# Altium schematic sheet Sheet_1 copy.schdoc
size 441 x 303 mm
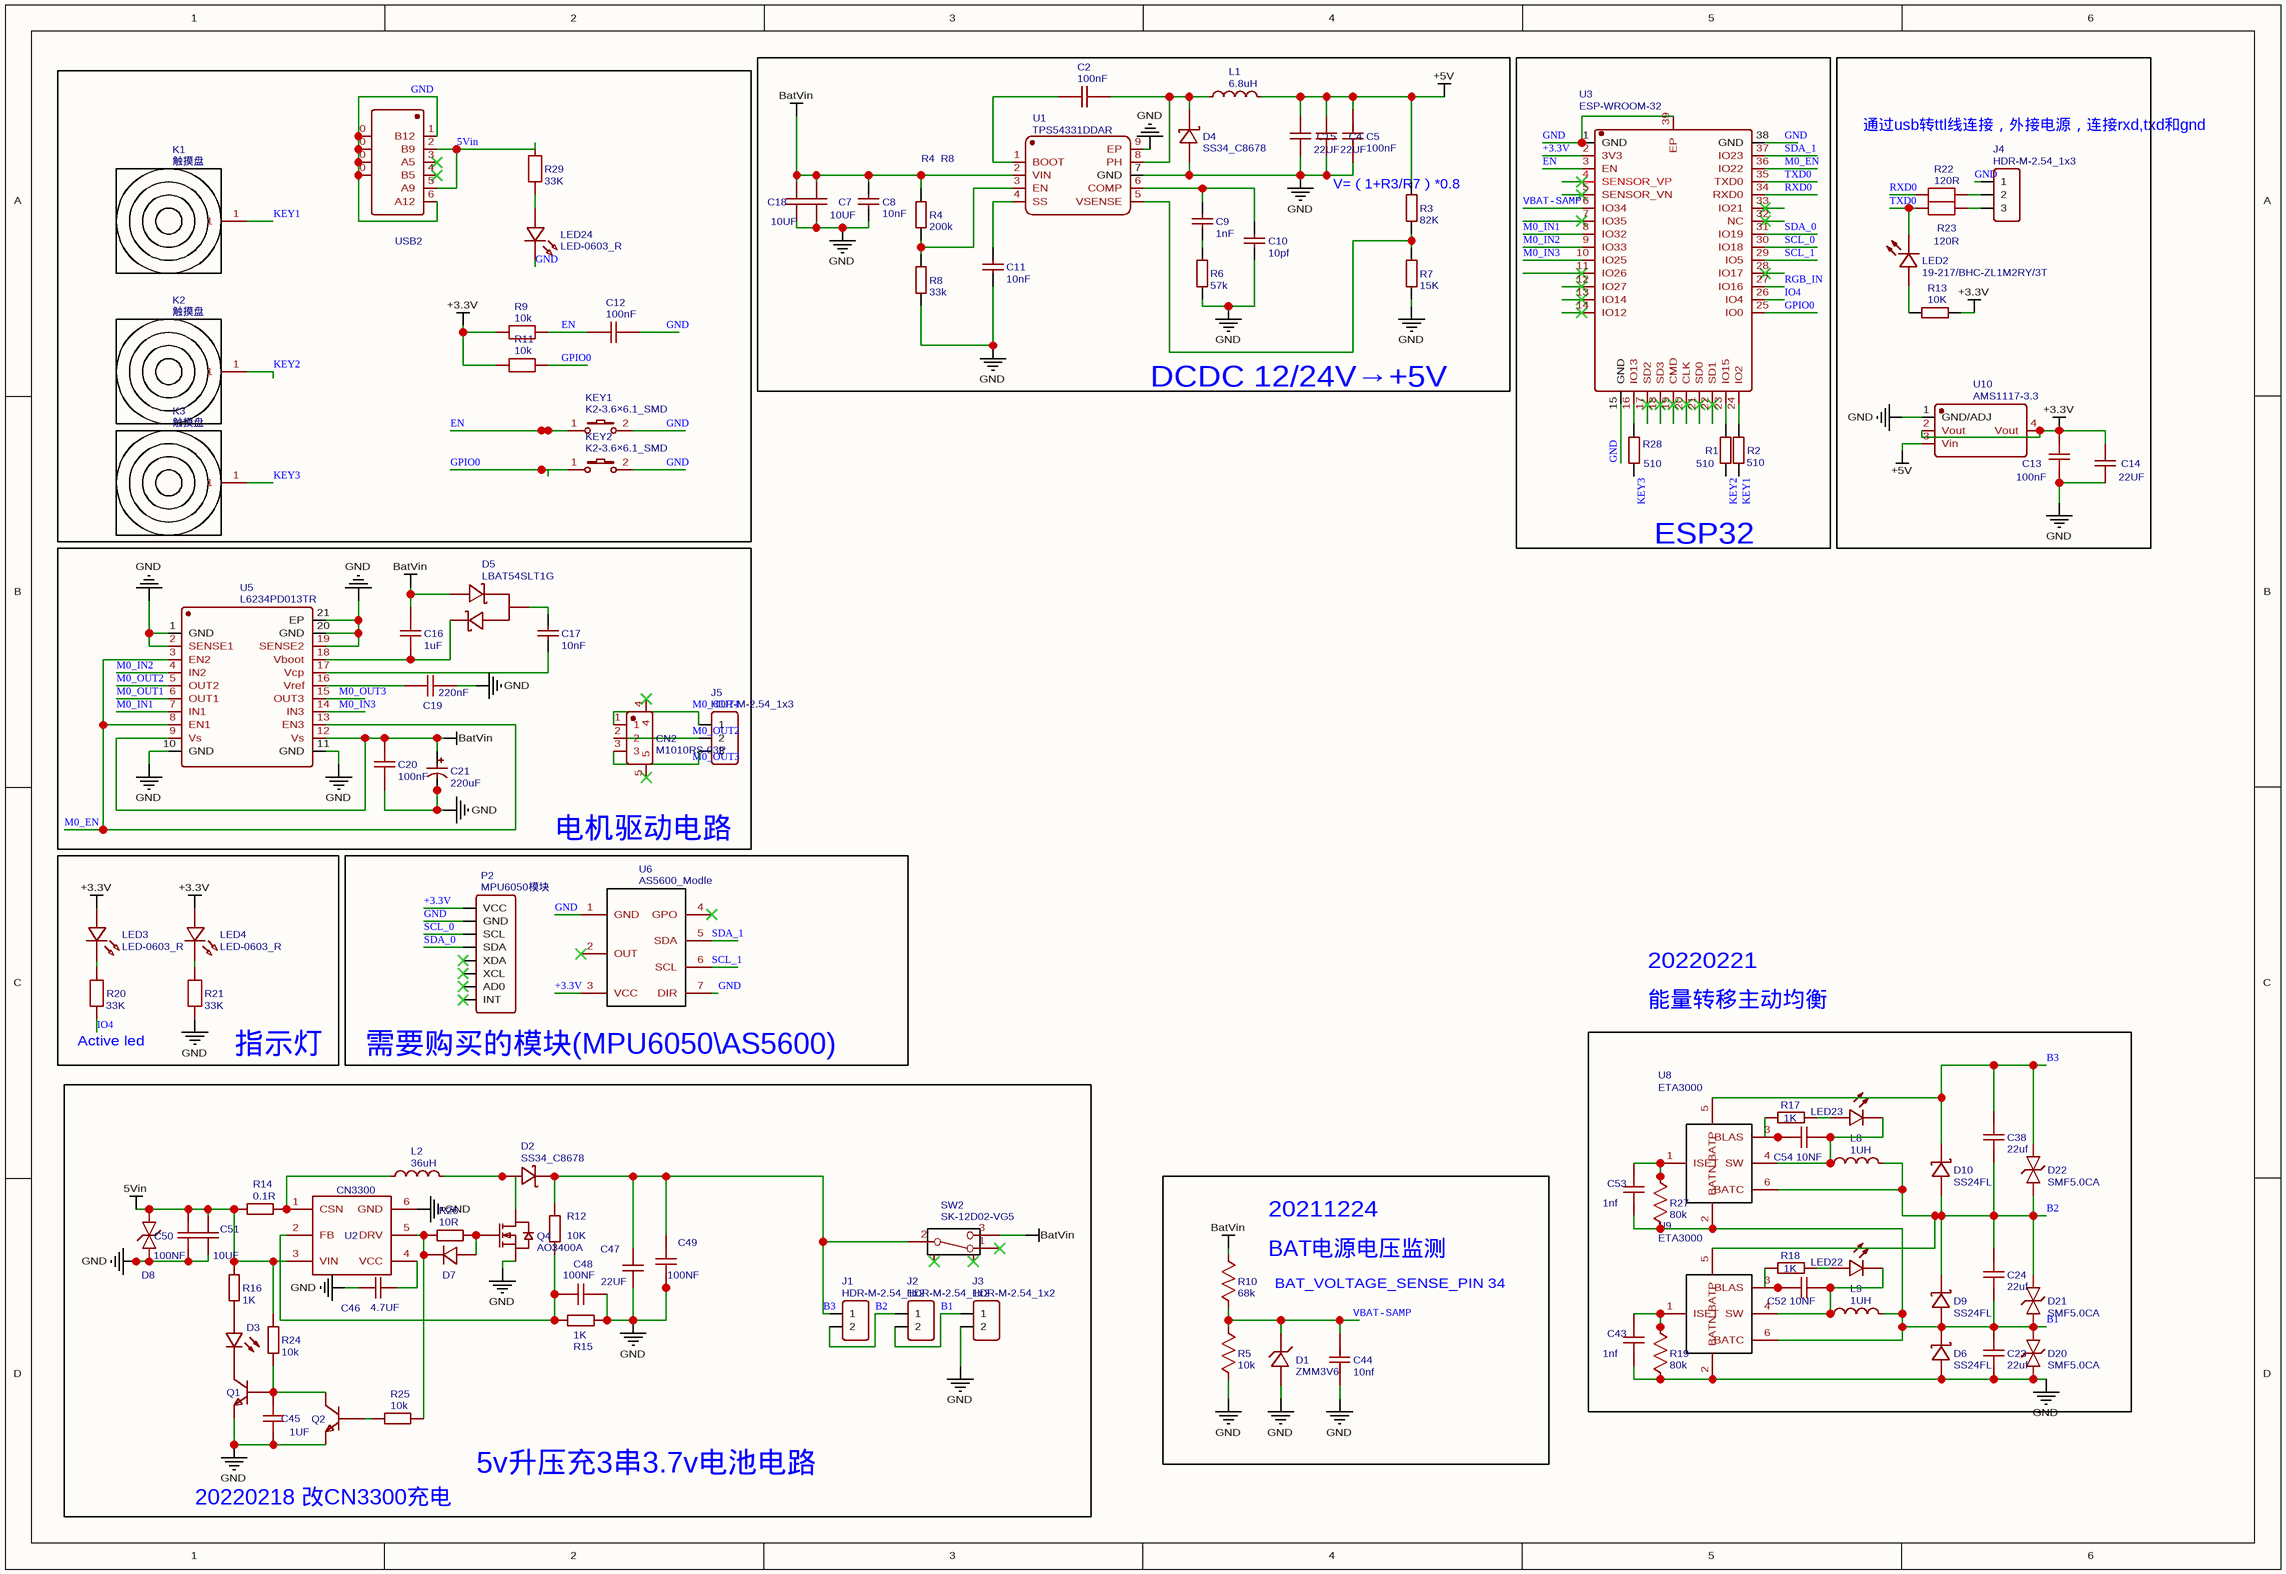
[diagram p0: Sheet_1 copy.schdoc]

## Parts
C2  100nF  [C0603]
C4  22UF  [C0805]
C5  100nF  [C0603]
C7  10UF  [C0805]
C8  10nF  [C0603]
C9  1nF  [C0603]
C10  10pf  [C0603]
C11  10nF  [C0603]
C12  100nF  [C0603]
C13  100nF  [C0603]
C14  22UF  [C0805]
C15  22UF  [C0805]
C16  1uF  [C0603]
C17  10nF  [C0603]
C18  10UF  [C0805]
C19  220nF  [C0603]
C20  100nF  [C0603]
C21  220uF  [CAP-TH_BD8.0-P3.50-D1.0-FD]
C23  22uf  [C0805]
C24  22uf  [C0805]
C38  22uf  [C0805]
C43  1nf  [C0603]
C44  10nf  [C0603]
C45  1UF  [C0603]
C46  4.7UF  [C0805]
C47  22UF  [C0805]
C48  100NF  [C0603]
C49  100NF  [C0603]
C50  100NF  [C0805]
C51  10UF  [C0805]
C52  10NF  [C0603]
C53  1nf  [C0603]
C54  10NF  [C0603]
CN2  M1010RS-03P  [CONN-SMD_M1010RS-03P]
D1  ZMM3V6  [LL-34_L3.5-W1.5-RD]
D2  SS34_C8678  [DO-214AC_L4.3-W2.7-LS5.3-RD]
D3  FC-DA1608HRK-620D  [LED-0603]  (value not drawn)
D4  SS34_C8678  [DO-214AC_L4.3-W2.7-LS5.3-RD]
D5  LBAT54SLT1G  [SOT-23_L2.9-W1.3-P1.90-LS2.4-BR]
D6  SS24FL  [SOD-123FL_L2.6-W1.6-LS3.4-RD]
D7  1N4148WS-C108805  [SOD-323_L1.8-W1.3-LS2.5-RD]  (value not drawn)
D8  SJD12C6.5L01  [SOD-123_L2.8-W1.8-LS3.7-BI]  (value not drawn)
D9  SS24FL  [SOD-123FL_L2.6-W1.6-LS3.4-RD]
D10  SS24FL  [SOD-123FL_L2.6-W1.6-LS3.4-RD]
D20  SMF5.0CA  [SOD-123FL_L2.8-W1.8-LS3.7-BI]
D21  SMF5.0CA  [SOD-123FL_L2.8-W1.8-LS3.7-BI]
D22  SMF5.0CA  [SOD-123FL_L2.8-W1.8-LS3.7-BI]
J1  HDR-M-2.54_1x2  [HDR-M-2.54_1X2]
J2  HDR-M-2.54_1x2  [HDR-M-2.54_1X2]
J3  HDR-M-2.54_1x2  [HDR-M-2.54_1X2]
J4  HDR-M-2.54_1x3  [HDR-M-2.54_1X3]
J5  HDR-M-2.54_1x3  [HDR-M-2.54_1X3]
K1  触摸盘  [TOUCHPAD]
K2  触摸盘  [TOUCHPAD]
K3  触摸盘  [TOUCHPAD]
KEY1  K2-3.6×6.1_SMD  [KEY-SMD_2P-L6.2-W3.6-LS8.0]
KEY2  K2-3.6×6.1_SMD  [KEY-SMD_2P-L6.2-W3.6-LS8.0]
L1  6.8uH  [IND-SMD_L7.3-W6.6]
L2  36uH  [IND-SMD_L7.3-W6.6]
L8  1UH  [IND-SMD_L7.0-W6.6_FXL0630]
L9  1UH  [IND-SMD_L7.0-W6.6_FXL0630]
LED2  19-217/BHC-ZL1M2RY/3T  [LED0603-R-RD]
LED3  LED-0603_R  [LED0603_RED]
LED4  LED-0603_R  [LED0603_RED]
LED22  FC-DA1608HRK-620D  [LED0603-R-FD]  (value not drawn)
LED23  FC-DA1608HRK-620D  [LED0603-R-FD]  (value not drawn)
LED24  LED-0603_R  [LED0603_RED]
P2  MPU6050模块  [MPU6050模块]
Q1  SS8050_C177739  [SOT-23-3_L2.9-W1.6-P1.90-LS2.8-BR]  (value not drawn)
Q2  SS8050_C177739  [SOT-23-3_L2.9-W1.6-P1.90-LS2.8-BR]  (value not drawn)
Q4  AO3400A  [SOT-23-3_L2.9-W1.6-P1.90-LS2.8-BR]
R1  510  [R0805]
R2  510  [R0805]
R3  82K  [R0603]
R4  200k  [R0603]
R5  10k  [R0603_NEW]
R6  57k  [R0603]
R7  15K  [R0603]
R8  33k  [R0603]
R9  10k  [R0603]
R10  68k  [R0603_NEW]
R11  10k  [R0603]
R12  10K  [R0603]
R13  10K  [R0603]
R14  0.1R  [R1206]
R15  1K  [R0603]
R16  1K  [R0603]
R17  1K  [R0603_NEW]
R18  1K  [R0603_NEW]
R19  80k  [R0603_NEW]
R20  33K  [R0603]
R21  33K  [R0603]
R22  120R  [R0603]
R23  120R  [R0603]
R24  10k  [R0603]
R25  10k  [R0603]
R26  10R  [R0603]
R27  80k  [R0603_NEW]
R28  510  [R0805]
R29  33K  [R0603]
SW2  SK-12D02-VG5  [SW-TH_SK-12D02-VG5]
U1  TPS54331DDAR  [SOIC-8_L5.0-W4.0-P1.27-LS6.0-BL-EP]
U2  CN3300  [SOT-23-6_L2.9-W1.6-P0.95-LS2.8-BL]
U3  ESP-WROOM-32  [WIFIM-SMD_ESP-WROOM-32]
U5  L6234PD013TR  [POWERSO20_L15.9-W11.0-P1.27-LS14.2-BL-EP]
U6  AS5600_Modle  [AS5600_MODLE]
U8  ETA3000  [SOT23-6L_6PIN-L3.02-W3.0-H1.2-PITCH0.95-BL]
U9  ETA3000  [SOT23-6L_6PIN-L3.02-W3.0-H1.2-PITCH0.95-BL]
U10  AMS1117-3.3  [SOT-223-3_L6.5-W3.4-P2.30-LS7.0-BR]
USB2  TYPE-C-31-M-17  [USB-C-SMD_10P-P1.00-L6.8-W8.9]  (value not drawn)

## Blocks framed on the sheet
V=（1+R3/R7）*0.8: C2 C4 C5 C7-C11 C15 C18 D4 L1 R3 R4 R6-R8 U1
通过usb转ttl线连接，外接电源，连接rxd,txd和gnd: C13 C14 J4 LED2 R13 R22 R23 U10
电机驱动电路: C16 C17 C19-C21 CN2 D5 J5 U5
指示灯: LED3 LED4 R20 R21
5v升压充3串3.7v电池电路: C45-C51 D2 D3 D7 D8 J1-J3 L2 Q1 Q2 Q4 R12 R14-R16 R24-R26 SW2 U2

## Nets
5Vin: C50.2 C51.1 D8.2 R14.1 R16.2 R24.2 R29.2 U2.3(VIN) USB2.2(B9) USB2.5(A9)
+3.3V: C13.2 C14.2 LED3.1 LED4.1 P2.1(VCC) R9.1 R11.1 R13.2 U3.2(3V3) U6.3(VCC) U10.2(Vout) U10.4(Vout)
+5V: C4.2 C5.2 C15.2 L1.2 R3.2 U10.3(Vin)
BatVin: C7.2 C8.2 C16.2 C18.2 C20.1 C21.1 D5.1(A) R4.2 R10.2 SW2.3 U1.2(VIN) U5.9(Vs) U5.12(Vs)
GND: C4.1 C5.1 C7.1 C8.1 C10.1 C11.1 C12.2 C13.1 C14.1 C15.1 C18.1 C19.2 C20.2 C21.2 C23.1 C43.2 C44.1 C45.1 C46.1 C47.1 C48.1 C49.1 C50.1 C51.2 D1.2(A) D4.2(A) D6.2(A) D8.1 D20.2 J3.2 J4.1 KEY1.2 KEY2.2 LED24.2 P2.2(GND) Q1.2(E) Q2.2(E) Q4.2(S) R5.1 R6.1 R7.1 R8.1 R15.2 R19.1 R21.1 U1.7(GND) U1.9(EP) U2.6(GND) U3.1(GND) U3.15(GND) U3.38(GND) U3.39(EP) U5.1(GND) U5.2(SENSE1) U5.10(GND) U5.11(GND) U5.19(SENSE2) U5.20(GND) U5.21(EP) U6.1(GND) U6.7(DIR) U9.2(BATN) U10.1(GND/ADJ) USB2.0 USB2.1(B12) USB2.6(A12)
B1: C23.2 C24.1 C53.2 D6.1(K) D9.2(A) D20.1 D21.2 J2.2 J3.1 L9.2 R27.1 U8.2(BATN) U9.6(BATC)
B2: C24.2 C38.1 D9.1(K) D10.2(A) D21.1 D22.2 J1.2 J2.1 L8.2 U8.6(BATC) U9.5(BATP)
B3: C38.2 C47.2 C49.2 D2.1(K) D10.1(K) D22.1 J1.1 R12.2 SW2.2 U8.5(BATP)
EN: C12.1 KEY1.1 R9.2 U3.3(EN)
GPIO0: KEY2.1 R11.2 U3.25(IO0)
IO4: R20.1 U3.26(IO4)
KEY1: K1.1 R2.1
KEY2: K2.1 R1.1
KEY3: K3.1 R28.1
M0_EN: U3.36(IO22) U5.3(EN2) U5.8(EN1) U5.13(EN3)
M0_IN1: U3.8(IO32) U5.7(IN1)
M0_IN2: U3.9(IO33) U5.4(IN2)
M0_IN3: U3.10(IO25) U5.14(IN3)
M0_OUT1: CN2.1 J5.1 U5.6(OUT1)
M0_OUT2: CN2.2 J5.2 U5.5(OUT2)
M0_OUT3: CN2.3 J5.3 U5.15(OUT3)
RGB_IN: U3.27(IO16)
RXD0: R22.1 U3.34(RXD0)
SCL_0: P2.3(SCL) U3.30(IO18)
SCL_1: U3.29(IO5) U6.6(SCL)
SDA_0: P2.4(SDA) U3.31(IO19)
SDA_1: U3.37(IO23) U6.5(SDA)
TXD0: LED2.2(K) R23.1 U3.35(TXD0)
VBAT-SAMP: C44.2 D1.1(C) R5.2 R10.1 U3.6(IO34)
NetC2_1: C2.1 U1.1(BOOT)
NetC2_2: C2.2 D4.1(K) L1.1 U1.8(PH)
NetC9_1: C9.1 R6.2
NetC9_2: C9.2 C10.2 U1.6(COMP)
NetC11_2: C11.2 U1.4(SS)
NetC16_1: C16.1 D5.2(K) U5.18(Vboot)
NetC17_1: C17.1 U5.17(Vcp)
NetC17_2: C17.2 D5.3(AK)
NetC19_1: C19.1 U5.16(Vref)
NetC43_1: C43.1 R19.2 U9.1(ISET)
NetC45_2: C45.2 Q1.1(B) Q2.3(C) R24.1
NetC46_2: C46.2 U2.4(VCC)
NetC48_2: C48.2 R12.1 R15.1 U2.2(FB)
NetC52_1: C52.1 R18.2 U9.3(BLAS)
NetC52_2: C52.2 L9.1 LED22.2(K) U9.4(SW)
NetC53_1: C53.1 R27.2 U8.1(ISET)
NetC54_1: C54.1 R17.2 U8.3(BLAS)
NetC54_2: C54.2 L8.1 LED23.2(K) U8.4(SW)
NetD2_2: D2.2(A) L2.2 Q4.3(D)
NetD3_1: D3.1(A) R16.1
NetD3_2: D3.2(K) Q1.3(C)
NetD7_1: D7.1(C) R25.1 R26.2 U2.5(DRV)
NetD7_2: D7.2(A) Q4.1(G) R26.1
NetJ4_2: J4.2 R22.2
NetJ4_3: J4.3 R23.2
NetL2_1: L2.1 R14.2 U2.1(CSN)
NetLED2_1: LED2.1(A) R13.1
NetLED3_2: LED3.2 R20.2
NetLED4_2: LED4.2 R21.2
NetLED22_1: LED22.1(A) R18.1
NetLED23_1: LED23.1(A) R17.1
NetLED24_1: LED24.1 R29.1
NetQ2_1: Q2.1(B) R25.2
NetR1_2: R1.2 U3.23(IO15)
NetR2_2: R2.2 U3.24(IO2)
NetR3_1: R3.1 R7.2 U1.5(VSENSE)
NetR4_1: R4.1 R8.2 U1.3(EN)
NetR28_2: R28.2 U3.16(IO13)

Not connected (* = marked no-connect by the designer): CN2 4* 5*; P2 5(XDA)* 6(XCL)* 7(AD0)* 8(INT)*; SW2 1* 4* 5*; U3 4(SENSOR_VP)* 5(SENSOR_VN)* 7(IO35)* 11(IO26)* 12(IO27)* 13(IO14)* 14(IO12)* 17(SD2)* 18(SD3)* 19(CMD)* 20(CLK)* 21(SD0)* 22(SD1)* 28(IO17)* 32(NC)* 33(IO21)*; U6 2(OUT)* 4(GPO)*; USB2 3(A5)* 4(B5)*

## Notes on the sheet
- (near R4) R4
- (near R4) R8
- DCDC 12/24V→+5V
- ESP32
- 20220221
- (near R20) Active led
- 需要购买的模块(MPU6050\AS5600)
- 能量转移主动均衡
- (near R10) BAT电源电压监测
- 20211224
- BAT_VOLTAGE_SENSE_PIN 34
- 20220218 改CN3300充电

## Library data of the parts
C2 C5 C12 C13 = 100nF: nameAlias: Value(F); Contributor: LCEDA_Lib; Package Display: No; BOM_Supplier Part: C14663; BOM_Supplier: LCSC; spicePre: C; spiceSymbolName: C_0603_US
C4 C14 C15 C47 = 22UF: BOM_Manufacturer Part: CL31A226KPHNNNE; BOM_Manufacturer: SAMSUNG; nameAlias: Capacitance; SMT Type: Extend; Package Display: No; BOM_Supplier: LCSC; BOM_Supplier Part: C5672; BOM_LCSC Assembly: Yes; spicePre: C; spiceSymbolName: CL31A226KPHNNNE
C7 C18 C51 = 10UF: BOM_Manufacturer Part: CL31A226KPHNNNE; BOM_Manufacturer: SAMSUNG; nameAlias: Capacitance; SMT Type: Extend; Package Display: No; BOM_Supplier: LCSC; BOM_Supplier Part: C5672; BOM_LCSC Assembly: Yes; spicePre: C; spiceSymbolName: CL31A226KPHNNNE
C8 C11 C17 = 10nF: BOM_Manufacturer: YAGEO; BOM_Manufacturer Part: CC0603KRX7R9BB103; nameAlias: Capacitance; BOM_Supplier: LCSC; BOM_Supplier Part: C100042; spicePre: C; spiceSymbolName: CC0603KRX7R9BB103; BOM_JLCPCB Part Class: Extended Part
C9 = 1nF: BOM_Manufacturer: YAGEO; BOM_Manufacturer Part: CC0603KRX7R9BB102; nameAlias: Capacitance; BOM_Supplier: LCSC; BOM_Supplier Part: C100040; spicePre: C; spiceSymbolName: CC0603KRX7R9BB102; BOM_JLCPCB Part Class: Extended Part
C10 = 10pf: BOM_Manufacturer: YAGEO; BOM_Manufacturer Part: CC0603JRNPO9BN470; nameAlias: Capacitance; BOM_Supplier: LCSC; BOM_Supplier Part: C105622; spicePre: C; spiceSymbolName: CC0603JRNPO9BN470; BOM_JLCPCB Part Class: Extended Part
C16 = 1uF: nameAlias: Value(F); Contributor: LCEDA_Lib; spicePre: C; spiceSymbolName: C_0603_US
C19 = 220nF: nameAlias: Value(F); Contributor: LCEDA_Lib; spicePre: C; spiceSymbolName: C_0603_US
C20 = 100nF: nameAlias: Value(F); Contributor: LCEDA_Lib; spicePre: C; spiceSymbolName: C_0603_US
C21 = 220uF: BOM_Manufacturer: ValuePro; BOM_Manufacturer Part: 220uf/35V; nameAlias: Capacitance; BOM_Supplier: LCSC; BOM_Supplier Part: C2063; spicePre: C; spiceSymbolName: 220uf/35V
C23 C24 C38 = 22uf: nameAlias: Value(F); Contributor: LCEDA_Lib; spicePre: C; spiceSymbolName: C_0805_US
C43 C53 = 1nf: nameAlias: Value(F); Contributor: LCEDA_Lib; spicePre: C; spiceSymbolName: C_0805_US
C44 = 10nf: nameAlias: Value(F); Contributor: LCEDA_Lib; spicePre: C; spiceSymbolName: C_0805_US
C45 = 1UF: nameAlias: Value(F); spicePre: C; spiceSymbolName: Cap_0603_US
C46 = 4.7UF: BOM_Manufacturer Part: CL31A226KPHNNNE; BOM_Manufacturer: SAMSUNG; nameAlias: Capacitance; SMT Type: Extend; Package Display: No; BOM_Supplier: LCSC; BOM_Supplier Part: C5672; BOM_LCSC Assembly: Yes; spicePre: C; spiceSymbolName: CL31A226KPHNNNE
C48-C50 = 100NF: nameAlias: Value(F); spicePre: C; spiceSymbolName: Cap_0603_US
C52 C54 = 10NF: nameAlias: Value(F); Contributor: LCEDA_Lib; spicePre: C; spiceSymbolName: C_0805_US
CN2 = M1010RS-03P: BOM_Manufacturer: XFCN(台湾兴飞); Contributor: LCSC; BOM_Supplier: LCSC; BOM_Supplier Part: C541845; BOM_Manufacturer Part: M1010RS-03P; BOM_JLCPCB Part Class: Extended Part; spicePre: C; spiceSymbolName: M1010RS-03P
D1 = ZMM3V6: BOM_Manufacturer: SEMTECH; SMT Type: Extend; BOM_Supplier: LCSC; BOM_Manufacturer Part: ZMM3V6; image: //image.lceda.cn/szlcsc/C8057.jpg; BOM_Supplier Part: C8057; BOM_LCSC Assembly: Yes; spicePre: D; spiceSymbolName: ZMM3V6
D2 D4 = SS34_C8678: BOM_Manufacturer Part: SS34; BOM_Manufacturer: MDD; BOM_Supplier: LCSC; BOM_Supplier Part: C8678; BOM_JLCPCB Part Class: Basic Part; spicePre: D; spiceSymbolName: SS34_C8678
D3 LED22 LED23 = FC-DA1608HRK-620D: BOM_Manufacturer: NATIONSTAR; Package Display: No; BOM_Supplier: LCSC; BOM_Manufacturer Part: FC-DA1608HRK-620D; BOM_Supplier Part: C84263; spicePre: L
D5 = LBAT54SLT1G: BOM_Manufacturer: LRC; BOM_Supplier: LCSC; BOM_Manufacturer Part: LBAT54SLT1G; BOM_Supplier Part: C12765; BOM_JLCPCB Part Class: Extended Part; spicePre: D; spiceSymbolName: LBAT54SLT1G
D6 D9 D10 = SS24FL: BOM_Manufacturer: KEXIN; Contributor: LCSC; BOM_Supplier: LCSC; BOM_Supplier Part: C489144; BOM_Manufacturer Part: SS24FL; BOM_JLCPCB Part Class: Extended Part; spicePre: D; spiceSymbolName: SS24FL_C489144
D7 = 1N4148WS-C108805: BOM_Manufacturer: Jingdao; BOM_Supplier: LCSC; BOM_Manufacturer Part: 1N4148WS; BOM_Supplier Part: C108805; spicePre: D; spiceSymbolName: 1N4148WS-C108805
D8 = SJD12C6.5L01: BOM_Manufacturer: Brightking Elec (TAIWAN); Contributor: LCSC; BOM_Supplier: LCSC; BOM_Supplier Part: C313294; BOM_Manufacturer Part: SJD12C6.5L01; spicePre: D; spiceSymbolName: SJD12C6.5L01
D20-D22 = SMF5.0CA: BOM_Manufacturer: SEMIWARE; Contributor: LCSC; BOM_Supplier: LCSC; BOM_Supplier Part: C908370; BOM_Manufacturer Part: SMF5.0CA; BOM_JLCPCB Part Class: Extended Part; spicePre: D; spiceSymbolName: SMF5.0CA_C908370
J1-J3 = HDR-M-2.54_1x2: Contributor: LCEDA_Lib; BOM_Supplier Part: C124375; BOM_Supplier: LCSC; spicePre: J; spiceSymbolName: HDR-M-2.54_1x2
J4 J5 = HDR-M-2.54_1x3: Contributor: LCEDA_Lib; BOM_Supplier Part: C180248; BOM_Supplier: LCSC; spicePre: J; spiceSymbolName: HDR-M-2.54_1x3
K1-K3 = 触摸盘: Contributor: Lisdon; spicePre: U
KEY1 KEY2 = K2-3.6×6.1_SMD: BOM_Manufacturer Part: K2-1107ST-A4SW-06; Contributor: LCEDA_Lib; 制造商: 韩国韩荣; BOM_Supplier Part: C118141; BOM_Supplier: LCSC; spicePre: K; spiceSymbolName: K2-3.6×6.1_SMD
L1 = 6.8uH: BOM_Manufacturer: TAITEC; BOM_Manufacturer Part: TMPC0624H-6R8MG-D; nameAlias: Inductance; Contributor: LCSC; BOM_Supplier: LCSC; BOM_Supplier Part: C357230; spicePre: L; spiceSymbolName: TMPC0624H-6R8MG-D
L2 = 36uH: BOM_Manufacturer: TAITEC; BOM_Manufacturer Part: TMPC0624H-6R8MG-D; nameAlias: Inductance; Contributor: LCSC; BOM_Supplier: LCSC; BOM_Supplier Part: C357230; spicePre: L; spiceSymbolName: TMPC0624H-6R8MG-D
L8 L9 = 1UH: BOM_Manufacturer Part: YXMAA0603-1R5M-ANF; BOM_Manufacturer: YUXIN TECH; nameAlias: Value(H); Contributor: LCEDA_Lib; BOM_Supplier Part: C241390; BOM_Supplier: LCSC; spicePre: L; spiceSymbolName: L0402_US
LED2 = 19-217/BHC-ZL1M2RY/3T: BOM_Manufacturer: EVERLIGHT; BOM_Supplier: LCSC; BOM_Manufacturer Part: 19-217/BHC-ZL1M2RY/3T; BOM_Supplier Part: C72041; BOM_JLCPCB Part Class: Basic Part; spicePre: L; spiceSymbolName: KT-0603R
LED3 LED4 LED24 = LED-0603_R: BOM_Manufacturer: EVERLIGHT(台湾亿光); BOM_Manufacturer Part: 19-217/R6C-AL1M2VY/3T; Contributor: LCEDA_01; BOM_Supplier Part: C72044; BOM_Supplier: LCSC; spicePre: L; spiceSymbolName: LED-0603_R
Q1 Q2 = SS8050_C177739: BOM_Manufacturer: Changjiang Electronics Tech (CJ); BOM_Manufacturer Part: SS8050; Contributor: LCSC; SMT Type: Extend; BOM_Supplier: LCSC; BOM_Supplier Part: C177739; BOM_LCSC Assembly: Yes; spicePre: Q; spiceSymbolName: SS8050_C177739
Q4 = AO3400A: BOM_Manufacturer: AOS; BOM_Supplier: LCSC; BOM_Manufacturer Part: AO3400A; BOM_Supplier Part: C20917; BOM_JLCPCB Part Class: Basic Part; spicePre: Q; spiceSymbolName: AO3400A
R1 R2 R28 = 510: BOM_Manufacturer: UniOhm; BOM_Manufacturer Part: 0603WAF1002T5E; nameAlias: Resistance (Ohms); SMT Type: Basic; BOM_Supplier: LCSC; BOM_LCSC Assembly: Yes; BOM_Supplier Part: C25804; spicePre: R; spiceSymbolName: 0603WAF1002T5E
R3 = 82K: BOM_Manufacturer: UniOhm; BOM_Manufacturer Part: 0603WAF1022T5E; nameAlias: Resistance (Ohms); SMT Type: Extend; BOM_Supplier: LCSC; BOM_Supplier Part: C22772; BOM_LCSC Assembly: Yes; spicePre: R; spiceSymbolName: 0603WAF1022T5E; BOM_JLCPCB Part Class: Extended Part
R4 = 200k: BOM_Manufacturer: UniOhm; BOM_Manufacturer Part: 0603WAF3323T5E; nameAlias: Resistance (Ohms); SMT Type: Extend; BOM_Supplier: LCSC; BOM_Supplier Part: C23139; BOM_LCSC Assembly: Yes; spicePre: R; spiceSymbolName: 0603WAF3323T5E; BOM_JLCPCB Part Class: Extended Part
R5 = 10k: nameAlias: Value(Ω); spicePre: R; spiceSymbolName: Res_0805(1/8W)_US
R6 = 57k: BOM_Manufacturer: UniOhm; BOM_Manufacturer Part: 0603WAF2492T5E; nameAlias: Resistance (Ohms); SMT Type: Extend; BOM_Supplier: LCSC; BOM_Supplier Part: C25962; BOM_LCSC Assembly: Yes; spicePre: R; spiceSymbolName: 0603WAF2492T5E; BOM_JLCPCB Part Class: Extended Part
R7 = 15K: BOM_Manufacturer: UniOhm; BOM_Manufacturer Part: 0603WAF3241T5E; nameAlias: Resistance (Ohms); SMT Type: Extend; BOM_Supplier: LCSC; BOM_Supplier Part: C22994; BOM_LCSC Assembly: Yes; spicePre: R; spiceSymbolName: 0603WAF3241T5E; BOM_JLCPCB Part Class: Extended Part
R8 = 33k: BOM_Manufacturer: UniOhm; BOM_Manufacturer Part: 0603WAF6812T5E; nameAlias: Resistance (Ohms); SMT Type: Extend; BOM_Supplier: LCSC; BOM_Supplier Part: C25976; BOM_LCSC Assembly: Yes; spicePre: R; spiceSymbolName: 0603WAF6812T5E; BOM_JLCPCB Part Class: Extended Part
R9 R11 = 10k: nameAlias: Value(Ω); Contributor: LCEDA_Lib; spicePre: R; spiceSymbolName: R_0603_EU
R10 = 68k: nameAlias: Value(Ω); spicePre: R; spiceSymbolName: Res_0805(1/8W)_US
R12 = 10K: BOM_Manufacturer Part: TC0525D1001T5E; BOM_Manufacturer: UniOhm; nameAlias: Resistance (Ohms); Package Display: No; BOM_Supplier: LCSC; BOM_Supplier Part: C44535; spicePre: R; spiceSymbolName: TC0525D1001T5E
R13 = 10K: BOM_Manufacturer: UniOhm; BOM_Manufacturer Part: 0603WAF1002T5E; nameAlias: Resistance (Ohms); BOM_Supplier: LCSC; BOM_Supplier Part: C25804; BOM_JLCPCB Part Class: Basic Part; spicePre: R; spiceSymbolName: 0603WAF1002T5E
R14 = 0.1R: BOM_Manufacturer: FH; BOM_Manufacturer Part: RS-03K103JT; nameAlias: Resistance (Ohms); Package Display: No; BOM_Supplier: LCSC; BOM_Supplier Part: C73809; spicePre: R; spiceSymbolName: RS-03K103JT
R15 = 1K: BOM_Manufacturer Part: TC0525D1001T5E; BOM_Manufacturer: UniOhm; nameAlias: Resistance (Ohms); Package Display: No; BOM_Supplier: LCSC; BOM_Supplier Part: C44535; spicePre: R; spiceSymbolName: TC0525D1001T5E
R16-R18 = 1K: BOM_Manufacturer: FH; BOM_Manufacturer Part: RS-03K103JT; nameAlias: Resistance (Ohms); Package Display: No; BOM_Supplier: LCSC; BOM_Supplier Part: C73809; spicePre: R; spiceSymbolName: RS-03K103JT
R19 R27 = 80k: nameAlias: Value(Ω); Contributor: LCEDA_Lib; spicePre: R; spiceSymbolName: R_0805_US
R20 R21 R29 = 33K: nameAlias: Value(Ω); Contributor: LCEDA_Lib; spicePre: R; spiceSymbolName: R_0603_EU
R22 R23 = 120R: nameAlias: Value(Ω); Contributor: LCEDA_Lib; BOM_Supplier Part: C103256; BOM_Supplier: LCSC; spicePre: R; spiceSymbolName: R_0603_EU
R24 R25 = 10k: BOM_Manufacturer: FH; BOM_Manufacturer Part: RS-03K103JT; nameAlias: Resistance (Ohms); Package Display: No; BOM_Supplier: LCSC; BOM_Supplier Part: C73809; spicePre: R; spiceSymbolName: RS-03K103JT
R26 = 10R: BOM_Manufacturer: FH; BOM_Manufacturer Part: RS-03K103JT; nameAlias: Resistance (Ohms); Package Display: No; BOM_Supplier: LCSC; BOM_Supplier Part: C73809; spicePre: R; spiceSymbolName: RS-03K103JT
SW2 = SK-12D02-VG5: BOM_Manufacturer: Rectangular Connectors - Contacts; Contributor: LCSC; BOM_Supplier: LCSC; BOM_Supplier Part: C136722; BOM_Manufacturer Part: SK-12D02-VG5; spicePre: S; spiceSymbolName: SK-12D02-VG5; BOM_JLCPCB Part Class: Extended Part
U1 = TPS54331DDAR: BOM_Manufacturer: TI; Contributor: 13471635540; SMT Type: Extend; BOM_Supplier: LCSC; BOM_Manufacturer Part: TPS54331DDAR; BOM_Supplier Part: C90761; BOM_LCSC Assembly: Yes; spicePre: U; spiceSymbolName: TPS54331DDAR
U2 = CN3300: BOM_Manufacturer: CONSONANCE; SMT Type: Extend; BOM_Supplier: LCSC; BOM_Manufacturer Part: CN3300; BOM_Supplier Part: C52375; BOM_LCSC Assembly: Yes; spicePre: U; spiceSymbolName: CN3300
U3 = ESP-WROOM-32: BOM_Manufacturer: ESPRESSIF; BOM_Supplier: LCSC; BOM_Manufacturer Part: ESP-WROOM-32; BOM_Supplier Part: C95209; spicePre: U; spiceSymbolName: ESP-WROOM-32
U5 = L6234PD013TR: BOM_Manufacturer: STMicroelectronics; BOM_Supplier: LCSC; BOM_Manufacturer Part: L6234PD013TR; BOM_Supplier Part: C77581; BOM_JLCPCB Part Class: Extended Part; spicePre: U; spiceSymbolName: L6234PD013TR
U6 = AS5600_Modle: Contributor: 45coll; spicePre: U; spiceSymbolName: AS5600_Modle; 淘宝ID: https://item.taobao.com/item.htm?spm=a1z09.2.0.0.2d022e8duL4IzW&id=622544987536&_u=31sddf3scb0c
U8 U9 = ETA3000: Contributor: mozixi; spicePre: U; spiceSymbolName: ETA3000
U10 = AMS1117-3.3: BOM_Manufacturer: AMS; sourceId: dwIGgezVh; timeStamp: 1476261164; BOM_Supplier: LCSC; BOM_Manufacturer Part: AMS1117-3.3; BOM_Supplier Part: C6186; BOM_JLCPCB Part Class: Basic Part; JLCPCB Part Class: Basic Part; spicePre: U; spiceSymbolName: AMS1117-3.3
USB2 = TYPE-C-31-M-17: BOM_Manufacturer: Korean Hroparts Elec; Contributor: LCSC; BOM_Supplier: LCSC; BOM_Supplier Part: C283540; BOM_Manufacturer Part: TYPE-C-31-M-17; spicePre: U; spiceSymbolName: TYPE-C-31-M-17
P2 = MPU6050模块: spicePre: P; spiceSymbolName: MPU6050模块